# EAGLE schematic PCB-164D316B_sch (EAGLE 9.6.2)
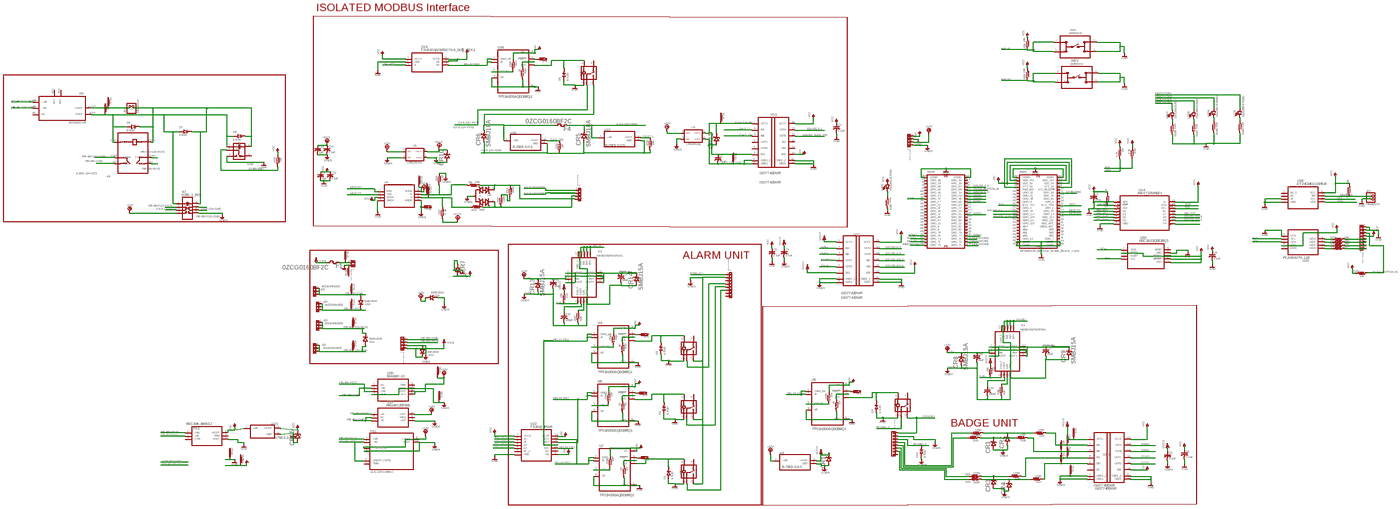
[diagram p0: schematic, sheet 1, overview]
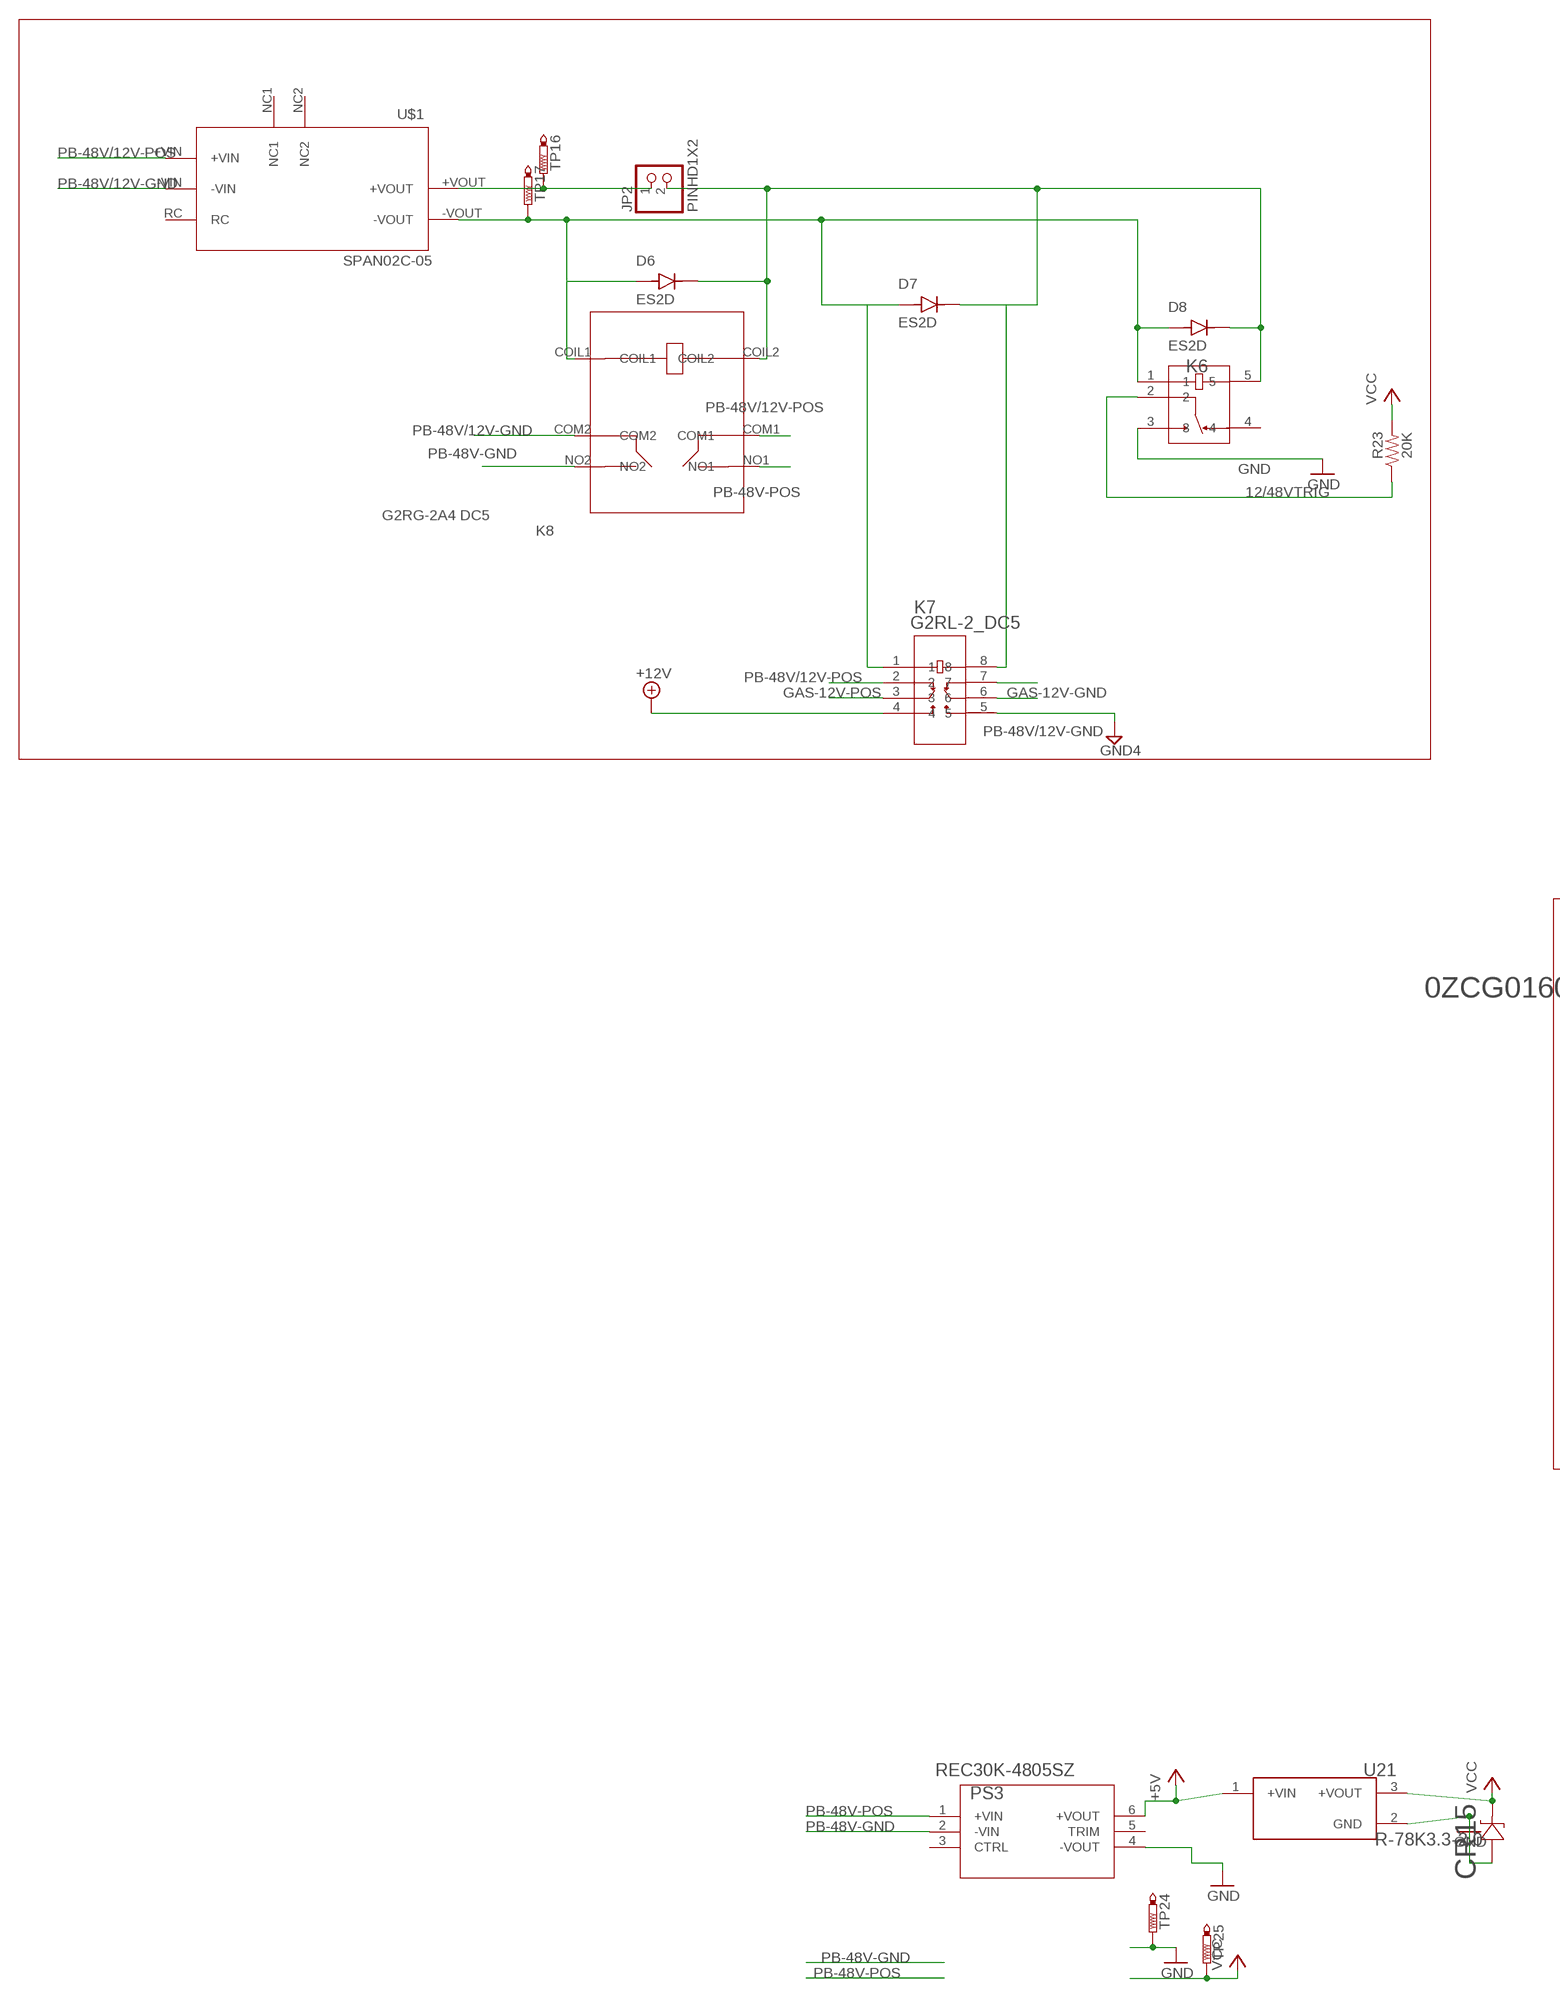
[diagram p1: schematic, sheet 1, part 1 of 4]
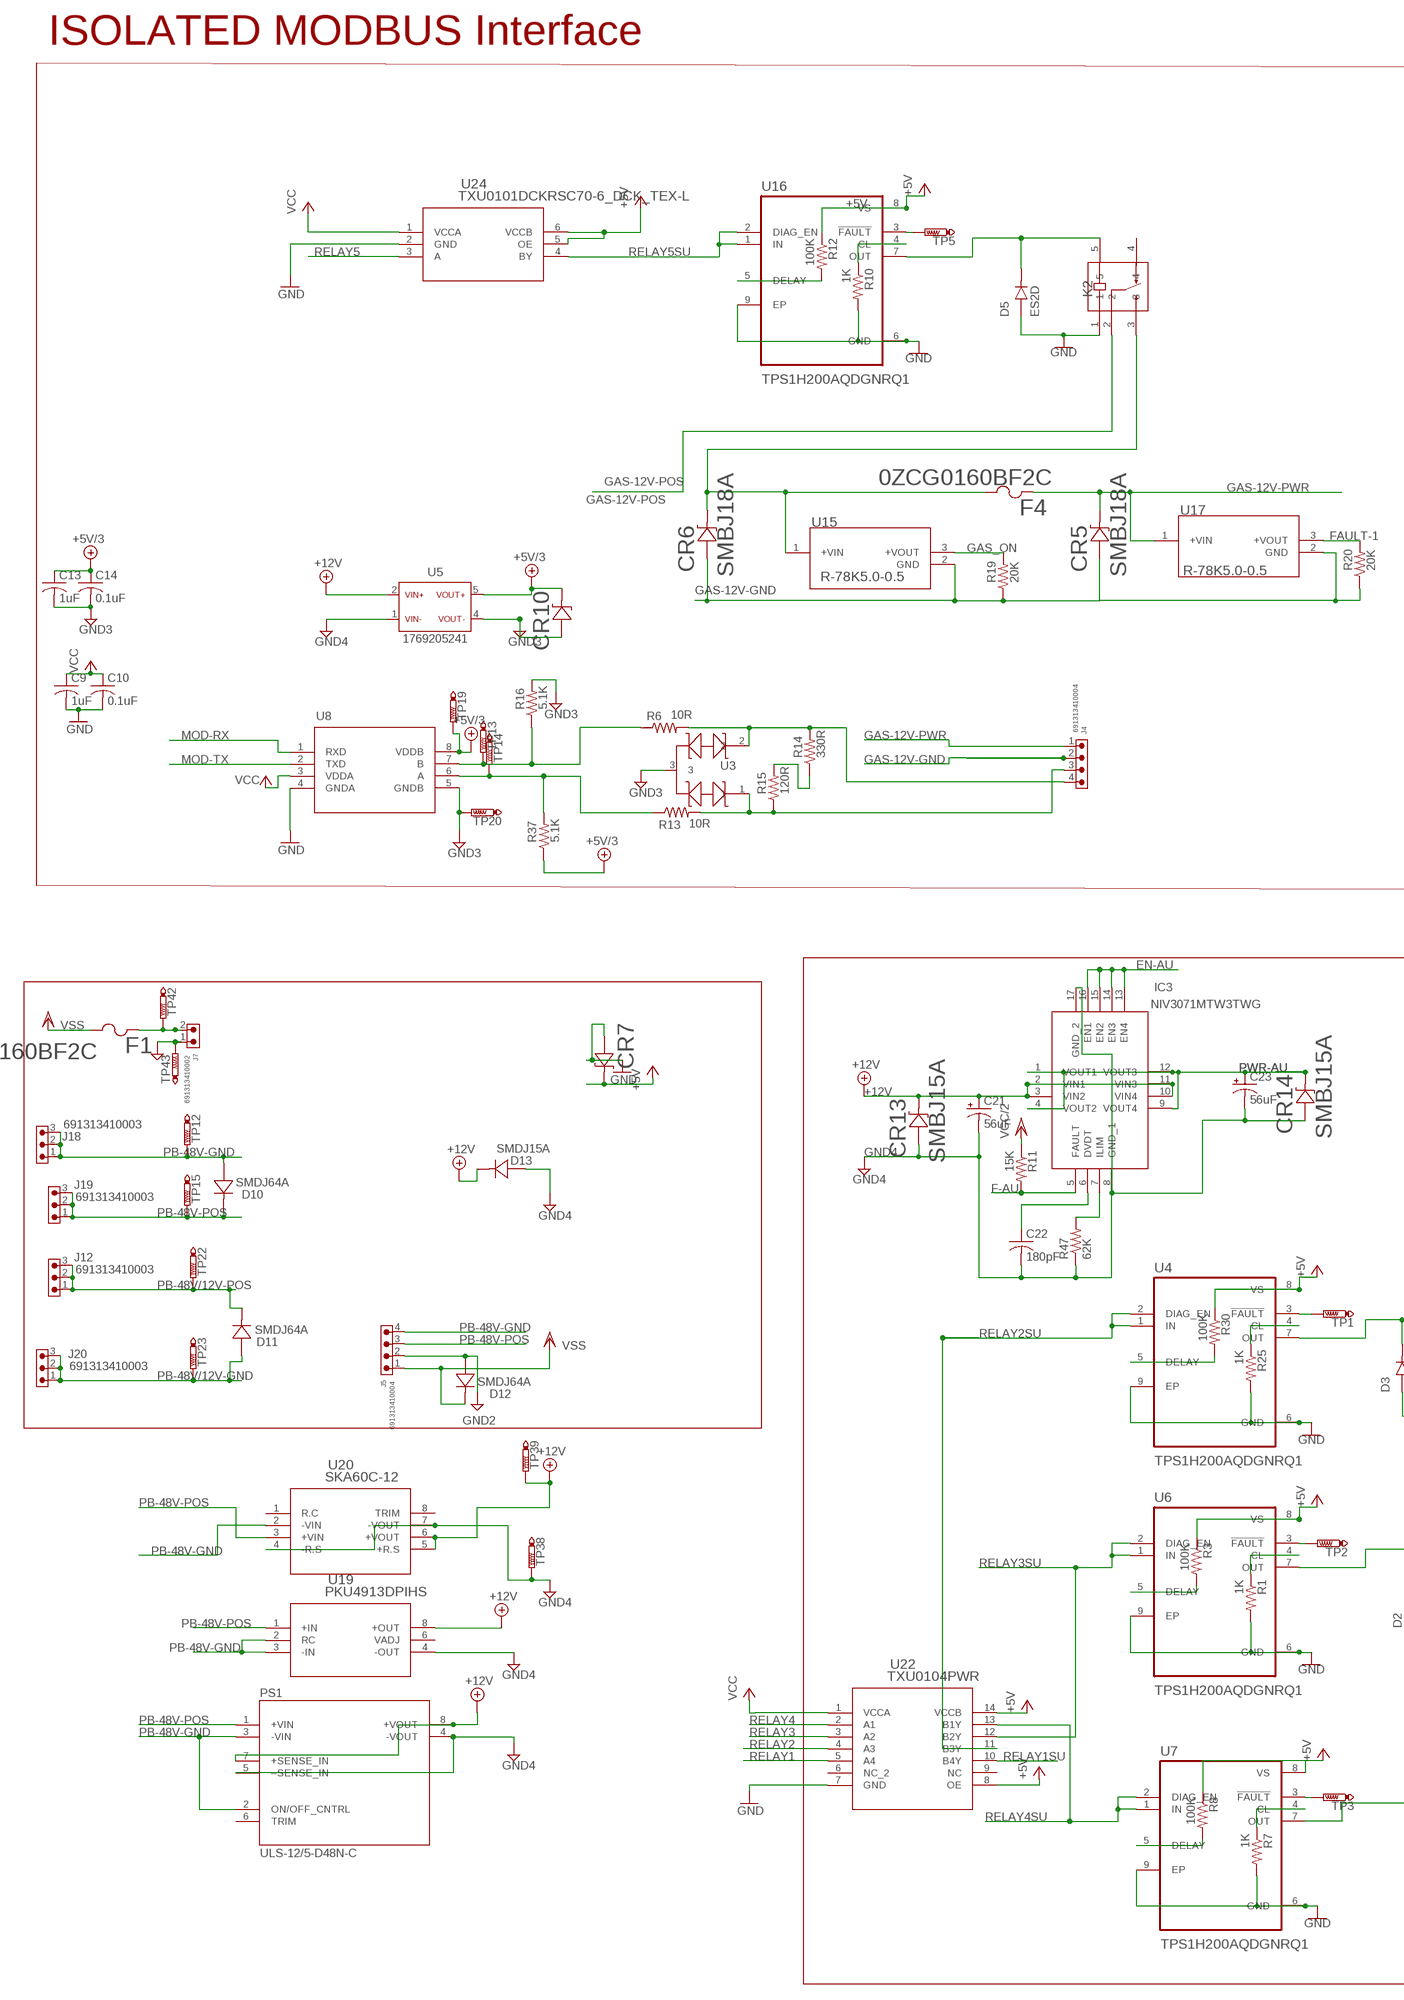
[diagram p2: schematic, sheet 1, part 2 of 4]
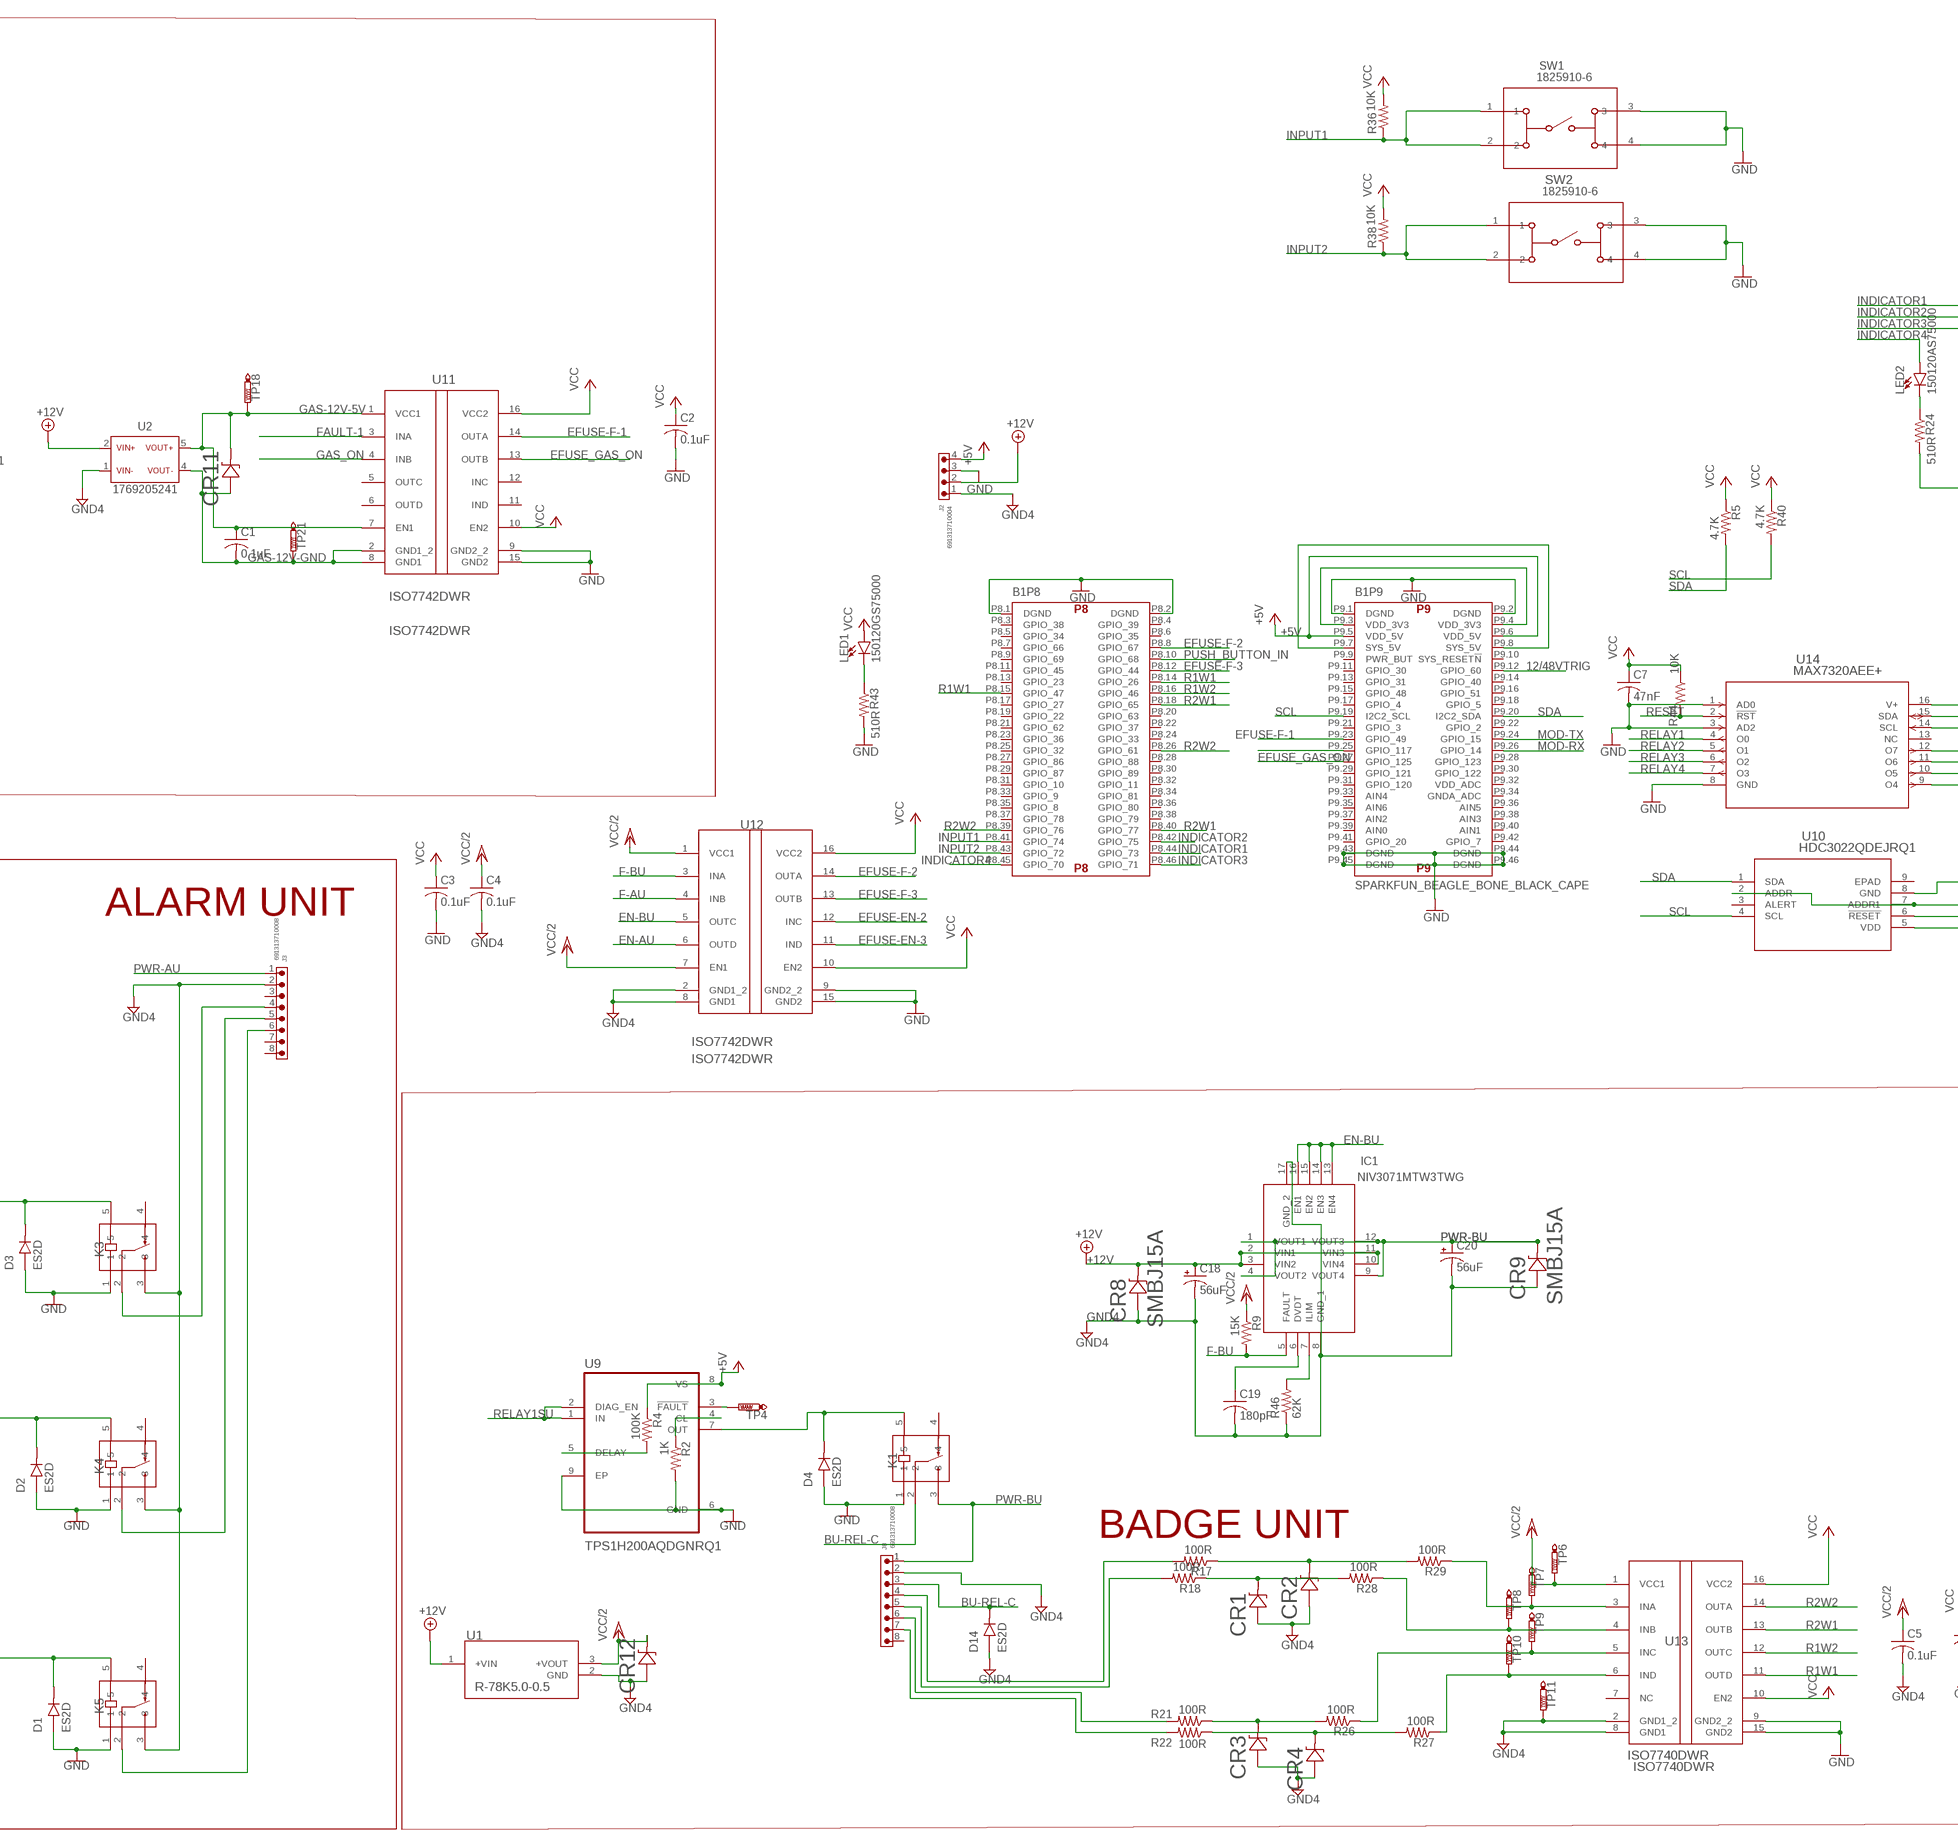
[diagram p3: schematic, sheet 1, part 3 of 4]
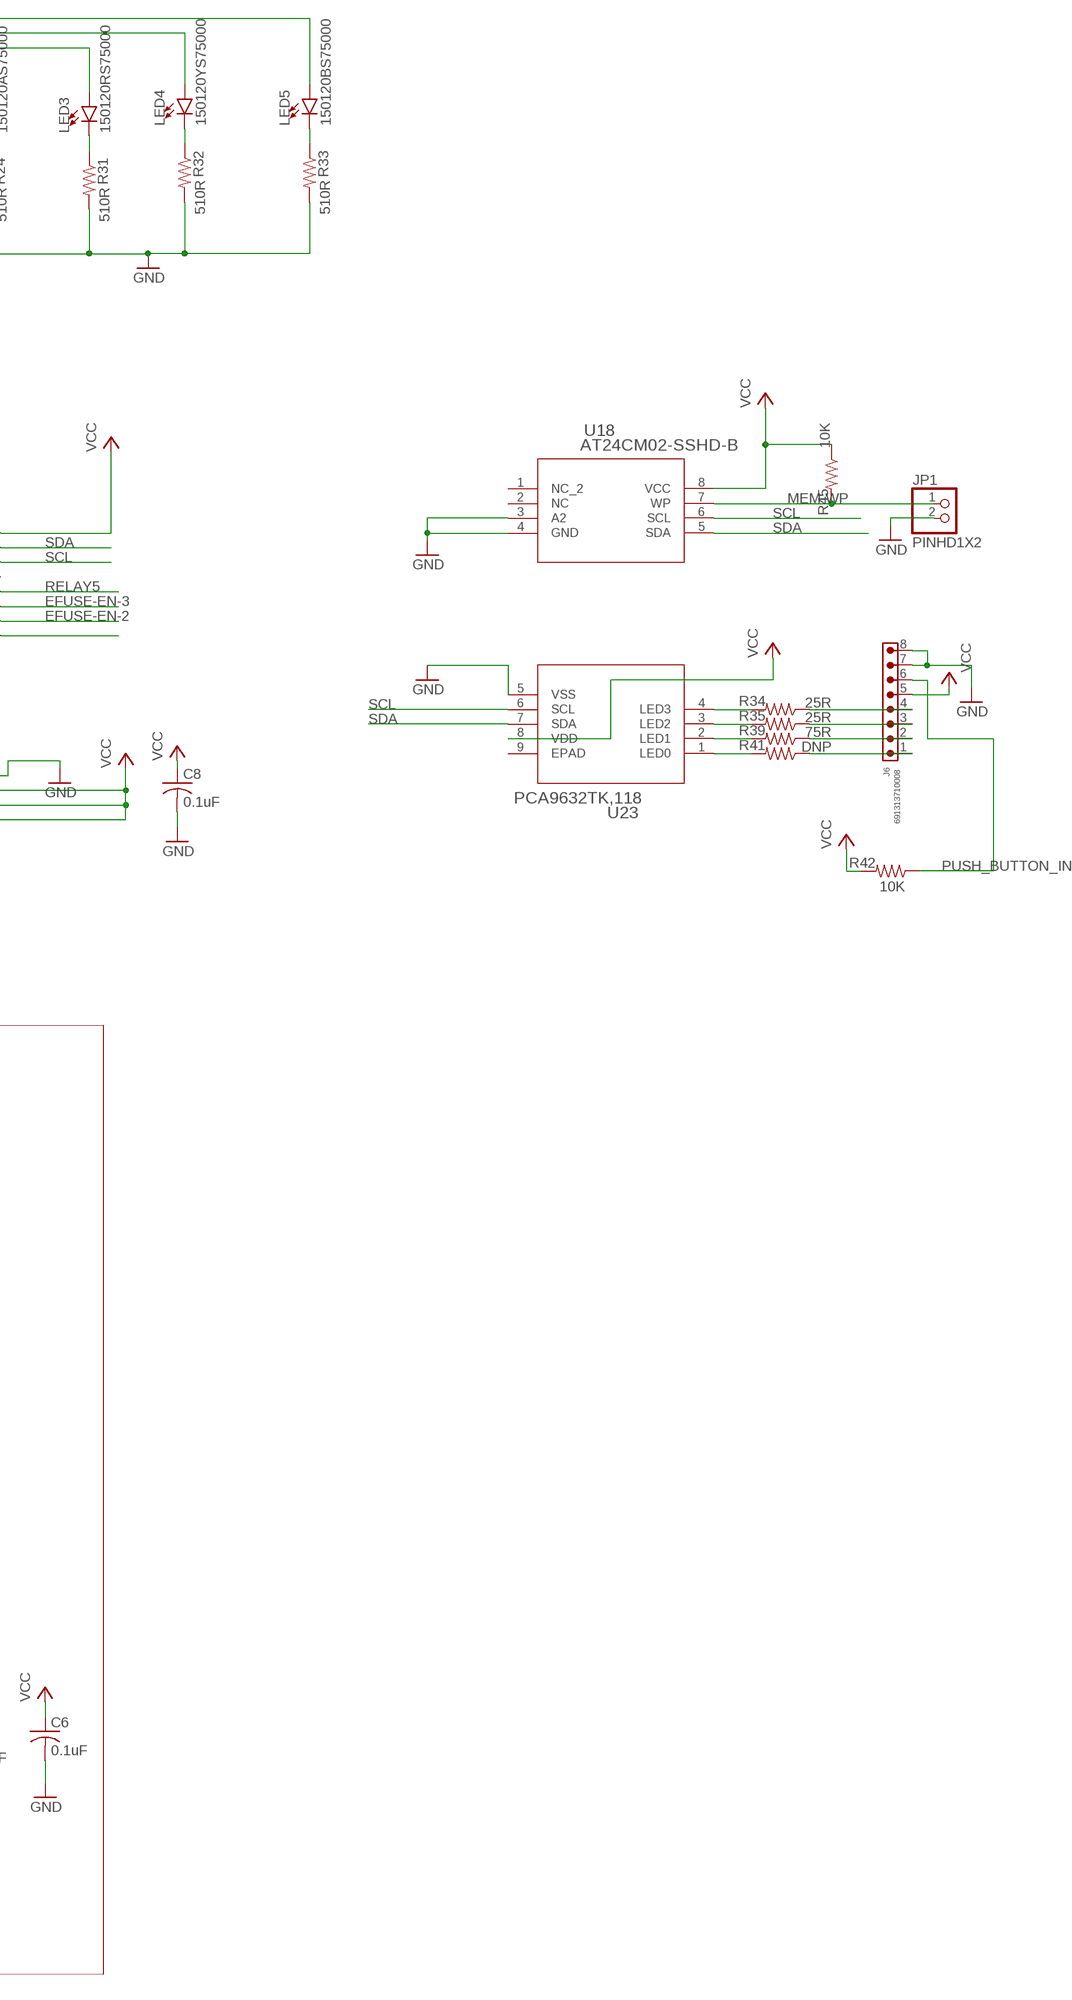
[diagram p4: schematic, sheet 1, part 4 of 4]

## Parts
B1  SPARKFUN_BEAGLE_BONE_BLACK_CAPE  [BEAGLE_BONE_BLACK_CAPE]
C1  0.1uF  C-USC1206  [C1206]
C2  0.1uF  C-USC1206  [C1206]
C3  0.1uF  C-USC1206  [C1206]
C4  0.1uF  C-USC1206  [C1206]
C5  0.1uF  C-USC1206  [C1206]
C6  0.1uF  C-USC1206  [C1206]
C7  47nF  C-USC1206  [C1206]
C8  0.1uF  C-USC1206  [C1206]
C9  1uF  C-USC1206  [C1206]
C10  0.1uF  C-USC1206  [C1206]
C13  1uF  C-USC1206  [C1206]
C14  0.1uF  C-USC1206  [C1206]
C18  56uF  CPOL-USC  [PANASONIC_C]
C19  180pF  C-USC1206  [C1206]
C20  56uF  CPOL-USC  [PANASONIC_C]
C21  56uF  CPOL-USC  [PANASONIC_C]
C22  180pF  C-USC1206  [C1206]
C23  56uF  CPOL-USC  [PANASONIC_C]
CR1  SMBJ6.0A  SMBJ5.0ADO-214AA(SMB_J-BEND)_LTF-M  [DO-214AA(SMB_J-BEND)_LTF-M]
CR2  SMBJ6.0A  SMBJ5.0ADO-214AA(SMB_J-BEND)_LTF-M  [DO-214AA(SMB_J-BEND)_LTF-M]
CR3  SMBJ6.0A  SMBJ5.0ADO-214AA(SMB_J-BEND)_LTF-M  [DO-214AA(SMB_J-BEND)_LTF-M]
CR4  SMBJ6.0A  SMBJ5.0ADO-214AA(SMB_J-BEND)_LTF-M  [DO-214AA(SMB_J-BEND)_LTF-M]
CR5  SMBJ18A  SMBJ5.0ADO-214AA(SMB_J-BEND)_LTF-M  [DO-214AA(SMB_J-BEND)_LTF-M]
CR6  SMBJ18A  SMBJ5.0ADO-214AA(SMB_J-BEND)_LTF-M  [DO-214AA(SMB_J-BEND)_LTF-M]
CR7  SMBJ6.0A  SMBJ5.0ADO-214AA(SMB_J-BEND)_LTF-M  [DO-214AA(SMB_J-BEND)_LTF-M]
CR8  SMBJ15A  SMBJ5.0ADO-214AA(SMB_J-BEND)_LTF-M  [DO-214AA(SMB_J-BEND)_LTF-M]
CR9  SMBJ15A  SMBJ5.0ADO-214AA(SMB_J-BEND)_LTF-M  [DO-214AA(SMB_J-BEND)_LTF-M]
CR10  SMBJ6.0A  SMBJ5.0ADO-214AA(SMB_J-BEND)_LTF-M  [DO-214AA(SMB_J-BEND)_LTF-M]
CR11  SMBJ6.0A  SMBJ5.0ADO-214AA(SMB_J-BEND)_LTF-M  [DO-214AA(SMB_J-BEND)_LTF-M]
CR12  SMBJ6.0A  SMBJ5.0ADO-214AA(SMB_J-BEND)_LTF-M  [DO-214AA(SMB_J-BEND)_LTF-M]
CR13  SMBJ15A  SMBJ5.0ADO-214AA(SMB_J-BEND)_LTF-M  [DO-214AA(SMB_J-BEND)_LTF-M]
CR14  SMBJ15A  SMBJ5.0ADO-214AA(SMB_J-BEND)_LTF-M  [DO-214AA(SMB_J-BEND)_LTF-M]
CR15  SMBJ6.0A  SMBJ5.0ADO-214AA(SMB_J-BEND)_LTF-M  [DO-214AA(SMB_J-BEND)_LTF-M]
D1  ES2D  [DIOM4336X265N]
D2  ES2D  [DIOM4336X265N]
D3  ES2D  [DIOM4336X265N]
D4  ES2D  [DIOM4336X265N]
D5  ES2D  [DIOM4336X265N]
D6  ES2D  [DIOM4336X265N]
D7  ES2D  [DIOM4336X265N]
D8  ES2D  [DIOM4336X265N]
D10  SMDJ64A  SMDJ64ASMDJSERIES_LTF-M  [SMDJSERIES_LTF-M]
D11  SMDJ64A  SMDJ64ASMDJSERIES_LTF-M  [SMDJSERIES_LTF-M]
D12  SMDJ64A  SMDJ64ASMDJSERIES_LTF-M  [SMDJSERIES_LTF-M]
D13  SMDJ15A  SMDJ64ASMDJSERIES_LTF-M  [SMDJSERIES_LTF-M]
D14  ES2D  [DIOM4336X265N]
F1  0ZCG0160BF2C  0ZCG0160BF2C0ZCG_BEL  [0ZCG_BEL]
F4  0ZCG0160BF2C  0ZCG0160BF2C0ZCG_BEL  [0ZCG_BEL]
IC1  NIV3071MTW3TWG  [QFN105P500X600X80-17N]
IC3  NIV3071MTW3TWG  [QFN105P500X600X80-17N]
J2  691313710004  691313710004  [691313710004]
J3  691313710008  691313710008  [691313710008]
J4  691313410004  691313410004  [691313410004]
J5  691313410004  691313410004  [691313410004]
J6  691313710008  691313710008  [691313710008]
J7  691313410002  691313410002  [691313410002]
J8  691313710008  691313710008  [691313710008]
J12  691313410003  691313410003  [691313410003]
J18  691313410003  691313410003  [691313410003]
J19  691313410003  691313410003  [691313410003]
J20  691313410003  691313410003  [691313410003]
JP1  PINHD1X2  PINHD-1X2  [1X02]
JP2  PINHD1X2  PINHD-1X2  [1X02]
K1  G5Q-14_DC5  G5Q-14_DC5RELAY_G5Q-1_DC5_OMR  [RELAY_G5Q-1_DC5_OMR]
K2  G5Q-14_DC5  G5Q-14_DC5RELAY_G5Q-1_DC5_OMR  [RELAY_G5Q-1_DC5_OMR]
K3  G5Q-14_DC5  G5Q-14_DC5RELAY_G5Q-1_DC5_OMR  [RELAY_G5Q-1_DC5_OMR]
K4  G5Q-14_DC5  G5Q-14_DC5RELAY_G5Q-1_DC5_OMR  [RELAY_G5Q-1_DC5_OMR]
K5  G5Q-14_DC5  G5Q-14_DC5RELAY_G5Q-1_DC5_OMR  [RELAY_G5Q-1_DC5_OMR]
K6  G5Q-14_DC5  G5Q-14_DC5RELAY_G5Q-1_DC5_OMR  [RELAY_G5Q-1_DC5_OMR]
K7  G2RL-2_DC5  G2RL-2_DC5RELAY_G2RL-2_OMR  [RELAY_G2RL-2_OMR]
K8  G2RG-2A4 DC5  OMRON_G2RG-2A-XDC12  [G2RG-2A4]
LED1  150120GS75000  LED1206  [LED-1206]
LED2  150120AS75000  LED1206  [LED-1206]
LED3  150120RS75000  LED1206  [LED-1206]
LED4  150120YS75000  LED1206  [LED-1206]
LED5  150120BS75000  LED1206  [LED-1206]
PS1  ULS-12/5-D48N-C  ULS-12/5-D48N-C  [CONV_ULS-12/5-D48N-C]
PS3  REC30K-4805SZ  REC20K-2405SZREC20K_RCP  [REC20K_RCP]
R1  1K  R-US_R1206  [R1206]
R2  1K  R-US_R1206  [R1206]
R3  100K  R-US_R1206  [R1206]
R4  100K  R-US_R1206  [R1206]
R5  4.7K  R-US_R1206  [R1206]
R6  10R  R-US_R1206  [R1206]
R7  1K  R-US_R1206  [R1206]
R8  100K  R-US_R1206  [R1206]
R9  15K  R-US_R1206  [R1206]
R10  1K  R-US_R1206  [R1206]
R11  15K  R-US_R1206  [R1206]
R12  100K  R-US_R1206  [R1206]
R13  10R  R-US_R1206  [R1206]
R14  330R  R-US_R1206  [R1206]
R15  120R  R-US_R1206  [R1206]
R16  5.1K  R-US_R1206  [R1206]
R17  100R  R-US_R1206  [R1206]
R18  100R  R-US_R1206  [R1206]
R19  20K  R-US_R1206  [R1206]
R20  20K  R-US_R1206  [R1206]
R21  100R  R-US_R1206  [R1206]
R22  100R  R-US_R1206  [R1206]
R23  20K  R-US_R1206  [R1206]
R24  510R  R-US_R1206  [R1206]
R25  1K  R-US_R1206  [R1206]
R26  100R  R-US_R1206  [R1206]
R27  100R  R-US_R1206  [R1206]
R28  100R  R-US_R1206  [R1206]
R29  100R  R-US_R1206  [R1206]
R30  100K  R-US_R1206  [R1206]
R31  510R  R-US_R1206  [R1206]
R32  510R  R-US_R1206  [R1206]
R33  510R  R-US_R1206  [R1206]
R34  25R  R-US_R1206  [R1206]
R35  25R  R-US_R1206  [R1206]
R36  10K  R-US_R1206  [R1206]
R37  5.1K  R-US_R1206  [R1206]
R38  10K  R-US_R1206  [R1206]
R39  75R  R-US_R1206  [R1206]
R40  4.7K  R-US_R1206  [R1206]
R41  DNP  R-US_R1206  [R1206]
R42  10K  R-US_R1206  [R1206]
R43  510R  R-US_R1206  [R1206]
R44  10K  R-US_R1206  [R1206]
R45  10K  R-US_R1206  [R1206]
R46  62K  R-US_R1206  [R1206]
R47  62K  R-US_R1206  [R1206]
SW1  1825910-6  1825910-6SW4_1825910-B_TEC  [SW4_1825910-B_TEC]
SW2  1825910-6  1825910-6SW4_1825910-B_TEC  [SW4_1825910-B_TEC]
TP1  TH  [SMALL-TH]
TP2  TH  [SMALL-TH]
TP3  TH  [SMALL-TH]
TP4  TH  [SMALL-TH]
TP5  TH  [SMALL-TH]
TP6  TH  [SMALL-TH]
TP7  TH  [SMALL-TH]
TP8  TH  [SMALL-TH]
TP9  TH  [SMALL-TH]
TP10  TH  [SMALL-TH]
TP11  TH  [SMALL-TH]
TP12  TH  [SMALL-TH]
TP13  TH  [SMALL-TH]
TP14  TH  [SMALL-TH]
TP15  TH  [SMALL-TH]
TP16  TH  [SMALL-TH]
TP17  TH  [SMALL-TH]
TP18  TH  [SMALL-TH]
TP19  TH  [SMALL-TH]
TP20  TH  [SMALL-TH]
TP21  TH  [SMALL-TH]
TP22  TH  [SMALL-TH]
TP23  TH  [SMALL-TH]
TP24  TH  [SMALL-TH]
TP25  TH  [SMALL-TH]
TP38  TH  [SMALL-TH]
TP39  TH  [SMALL-TH]
TP42  TH  [SMALL-TH]
TP43  TH  [SMALL-TH]
U1  R-78K5.0-0.5  R-78K5.0-0.5SIP3_R-78K-0.5_RCP  [SIP3_R-78K-0.5_RCP]
U2  1769205241  WPME-FISM_SMT-8_1769205241_L13.2W11.4H7.25  [WPME-FISM_SMT-8_L13.2W11.4H7.25]
U3  SM712.TCT  SM712.TCTSOT23_SEM-M  [SOT23_SEM-M]
U4  TPS1H200AQDGNRQ1  [SOP65P490X110-9N]
U5  1769205241  WPME-FISM_SMT-8_1769205241_L13.2W11.4H7.25  [WPME-FISM_SMT-8_L13.2W11.4H7.25]
U6  TPS1H200AQDGNRQ1  [SOP65P490X110-9N]
U7  TPS1H200AQDGNRQ1  [SOP65P490X110-9N]
U8  MAX22026FAWA+  MAX22026FAWA+21-0262_W8MS+1_ADI-M  [21-0262_W8MS+1_ADI-M]
U9  TPS1H200AQDGNRQ1  [SOP65P490X110-9N]
U10  HDC3022QDEJRQ1  HDC3022QDEJRQ1WSON8_DEJ_TEX-M  [WSON8_DEJ_TEX-M]
U11  ISO7742DWR  ISO7742DWRDW0016B_HV  [DW0016B_HV]
U12  ISO7742DWR  ISO7742DWRDW0016B_HV  [DW0016B_HV]
U13  ISO7740DWR  ISO7740DWRDW0016B_HV  [DW0016B_HV]
U14  MAX7320AEE+  MAX7320AEE+T21-0055H_16_MXM-M  [21-0055H_16_MXM-M]
U15  R-78K5.0-0.5  R-78K5.0-0.5SIP3_R-78K-0.5_RCP  [SIP3_R-78K-0.5_RCP]
U16  TPS1H200AQDGNRQ1  [SOP65P490X110-9N]
U17  R-78K5.0-0.5  R-78K5.0-0.5SIP3_R-78K-0.5_RCP  [SIP3_R-78K-0.5_RCP]
U18  AT24CM02-SSHD-B  AT24CM02-SSHD-BSOIC8_4P9X3P9MC_MCH-L  [SOIC8_4P9X3P9MC_MCH-L]
U19  PKU4913DPIHS  PKU4913DPIHSPKU4913DPIHS_FPM  [PKU4913DPIHS_FPM]
U20  SKA60C-12  SKA60C-12SKA60_MWU  [SKA60_MWU]
U21  R-78K3.3-2.0  [CONV_R-78K3.3-2.0]
U22  TXU0104PWR  TXU0104PWRTSSOP_0104PWR_TEX-L  [TSSOP_0104PWR_TEX-L]
U23  PCA9632TK,118  PCA9632TK,118HVSON8_3X3_NXP  [HVSON8_3X3_NXP]
U24  TXU0101DCKRSC70-6_DCK_TEX-L  [SC70-6_DCK_TEX-L]
U$1  SPAN02C-05  MEANWELLSPBW03G-12  [SPBW03G-12]

## Nets
12/48VTRIG: B1.P9.12(P9:GPIO_60) K6.2 R23.1
+5V: B1.P9.5(P9:VDD_5V) B1.P9.6(P9:VDD_5V) CR7.1(CATHODE) J2.4 PS3.6(+VOUT) R3.1 R4.1 R8.1 R12.1 R30.1 U4.8(VS) U6.8(VS) U7.8(VS) U9.8(VS) U16.8(VS) U21.1(+VIN) U22.8(OE) U22.14(VCCB) U24.5(OE) U24.6(VCCB)
+5V/3: C13.1 C14.1 CR10.1(CATHODE) R37.1 TP19.P$1(TP) U5.5(+VOUT) U8.8(VDDB)
+12V: C18.+ C21.+ CR8.1(CATHODE) CR13.1(CATHODE) D13.1 IC1.2(VIN1) IC1.3(VIN2) IC1.10(VIN4) IC1.11(VIN3) IC3.2(VIN1) IC3.3(VIN2) IC3.10(VIN4) IC3.11(VIN3) J2.2 K7.4 PS1.7(+SENSE_IN) PS1.8(+VOUT) TP39.P$1(TP) U1.1(+VIN) U2.2(+VIN) U5.2(+VIN) U19.8(+OUT) U20.5(+R.S) U20.6(+VOUT)
BU-REL-C: D14.C(K) J8.3 K1.2
EFUSE-EN-2: U12.12(INC) U14.10(O5)
EFUSE-EN-3: U12.11(IND) U14.11(O6)
EFUSE-F-1: B1.P9.23(P9:GPIO_49) U11.14(OUTA)
EFUSE-F-2: B1.P8.8(P8:GPIO_67) U12.14(OUTA)
EFUSE-F-3: B1.P8.12(P8:GPIO_44) U12.13(OUTB)
EFUSE_GAS_ON: B1.P9.27(P9:GPIO_125) U11.13(OUTB)
EN-AU: IC3.13(EN4) IC3.14(EN3) IC3.15(EN2) IC3.16(EN1) U12.6(OUTD)
EN-BU: IC1.13(EN4) IC1.14(EN3) IC1.15(EN2) IC1.16(EN1) U12.5(OUTC)
F-AU: IC3.5(FAULT) R11.2 U12.4(INB)
F-BU: IC1.5(FAULT) R9.2 U12.3(INA)
FAULT-1: R20.2 U11.3(INA) U17.3(+VOUT)
GAS-12V-5V: C1.1 CR11.1(CATHODE) TP18.P$1(TP) U2.5(+VOUT) U11.1(VCC1) U11.7(EN1)
GAS-12V-GND: C1.2 CR5.2(ANODE) CR6.2(ANODE) CR11.2(ANODE) J4.2 K7.6 R19.1 R20.1 TP21.P$1(TP) U2.4(-VOUT) U11.2(GND1_2) U11.8(GND1) U15.2(GND) U17.2(GND)
GAS-12V-POS: K2.2 K7.3
GAS-12V-PWR: CR5.1(CATHODE) F4.1 J4.1 U17.1(+VIN)
GAS_ON: R19.2 U11.4(INB) U15.3(+VOUT)
GND: B1.P8.1(P8:DGND) B1.P8.2(P8:DGND) B1.P9.1(P9:DGND) B1.P9.2(P9:DGND) B1.P9.43(P9:DGND) B1.P9.44(P9:DGND) B1.P9.45(P9:DGND) B1.P9.46(P9:DGND) C2.2 C3.2 C6.2 C7.2 C8.2 C9.2 C10.2 CR7.2(ANODE) CR15.2(ANODE) D1.A D2.A D3.A D4.A D5.A J2.3 J6.7 J6.8 JP1.2 K1.1 K2.1 K3.1 K4.1 K5.1 K6.3 PS3.4(-VOUT) R1.2 R2.2 R7.2 R10.2 R24.2 R25.2 R31.2 R32.2 R33.2 R43.2 SW1.3 SW1.4 SW2.3 SW2.4 TP24.P$1(TP) U4.6(GND) U4.9(EP) U6.6(GND) U6.9(EP) U7.6(GND) U7.9(EP) U8.4(GNDA) U9.6(GND) U9.9(EP) U10.8(GND) U11.9(GND2_2) U11.15(GND2) U12.9(GND2_2) U12.15(GND2) U13.9(GND2_2) U13.15(GND2) U14.1(AD0) U14.3(AD2) U14.8(GND) U16.6(GND) U16.9(EP) U18.3(A2) U18.4(GND) U21.2(GND) U22.7(GND) U23.5(VSS) U24.2(GND)
GND2 [Power]: D12.2 J5.2 J7.1 TP43.P$1(TP)
GND3: C13.2 C14.2 CR10.2(ANODE) R16.2 TP20.P$1(TP) U3.3 U5.4(-VOUT) U8.5(GNDB)
GND4: C4.2 C5.2 C18.- C19.2 C20.- C21.- C22.2 C23.- CR1.2(ANODE) CR2.2(ANODE) CR3.2(ANODE) CR4.2(ANODE) CR8.2(ANODE) CR9.2(ANODE) CR12.2(ANODE) CR13.2(ANODE) CR14.2(ANODE) D13.2 D14.A IC1.8(GND_1) IC1.17(GND_2) IC3.8(GND_1) IC3.17(GND_2) J2.1 J3.2 J8.2 K3.3 K4.3 K5.3 K7.5 PS1.4(-VOUT) PS1.5(–SENSE_IN) R46.1 R47.1 TP11.P$1(TP) TP38.P$1(TP) U1.2(GND) U2.1(-VIN) U5.1(-VIN) U12.2(GND1_2) U12.8(GND1) U13.2(GND1_2) U13.8(GND1) U19.4(-OUT) U20.4(-R.S) U20.7(-VOUT)
INDICATOR1: B1.P8.44(P8:GPIO_73) LED5.A
INDICATOR2: B1.P8.42(P8:GPIO_75) LED4.A
INDICATOR3: B1.P8.46(P8:GPIO_71) LED3.A
INDICATOR4: B1.P8.45(P8:GPIO_70) LED2.A
INPUT1: B1.P8.41(P8:GPIO_74) R36.1 SW1.1 SW1.2
INPUT2: B1.P8.43(P8:GPIO_72) R38.1 SW2.1 SW2.2
MEM-WP: JP1.1 R45.2 U18.7(WP)
MOD-RX: B1.P9.26(P9:GPIO_14) U8.1(RXD)
MOD-TX: B1.P9.24(P9:GPIO_15) U8.2(TXD)
N$1: CR6.1(CATHODE) F4.2 K2.3 U15.1(+VIN)
N$2: R2.1 U9.4(CL)
N$3: D3.C(K) K3.5 U4.7(OUT)
N$4: R1.1 U6.4(CL)
N$5: TP1.P$1(TP) U4.3(!FAULT)
N$6: R28.1 TP8.P$1(TP) U13.4(INB)
N$7: CR3.1(CATHODE) R21.1 R26.2
N$8: CR4.1(CATHODE) R22.1 R27.2
N$9: CR2.1(CATHODE) R17.1 R29.2
N$10: R29.1 TP7.P$1(TP) U13.3(INA)
N$11: CR1.1(CATHODE) R18.1 R28.2
N$12: R4.2 U9.5(DELAY)
N$13: R6.1 R16.1 TP13.P$1(TP) U8.7(B)
N$14: R14.1 R15.2
N$15: TP4.P$1(TP) U9.3(!FAULT)
N$16: R13.1 R37.2 TP14.P$1(TP) U8.6(A)
N$17: J4.4 R6.2 R14.2 U3.2
N$18: R10.1 U16.4(CL)
N$19: D1.C(K) K5.5 U7.7(OUT)
N$20: B1.P9.25(P9:GPIO_117)
N$21: R12.2 U16.5(DELAY)
N$22: R3.2 U6.5(DELAY)
N$23: B1.P9.3(P9:VDD_3V3) B1.P9.4(P9:VDD_3V3)
N$24: J3.6 K5.2
N$25: B1.P9.7(P9:SYS_5V) B1.P9.8(P9:SYS_5V)
N$26: J3.5 K4.2
N$27: R26.1 TP9.P$1(TP) U13.5(INC)
N$28: J3.4 K3.2
N$29: D5.C(K) K2.5 U16.7(OUT)
N$30: D2.C(K) K4.5 U6.7(OUT)
N$31: R7.1 U7.4(CL)
N$32: C19.1 IC1.6(DVDT)
N$33: TP3.P$1(TP) U7.3(!FAULT)
N$34: TP5.P$1(TP) U16.3(!FAULT)
N$35: R27.1 TP10.P$1(TP) U13.6(IND)
N$36: D6.A D7.A D8.A K6.1 K7.1 K8.COIL1 TP17.P$1(TP) U$1.-VOUT
N$37: R8.2 U7.5(DELAY)
N$38: J8.4 R17.2
N$39: J8.5 R18.2
N$40: J8.6 R21.2
N$41: J8.7 R22.2
N$42: TP2.P$1(TP) U6.3(!FAULT)
N$43: D4.C(K) K1.5 U9.7(OUT)
N$44: JP2.1 TP16.P$1(TP) U$1.+VOUT
N$45: U14.9(O4)
N$47: IC1.7(ILIM) R46.2
N$48: J4.3 R13.2 R15.1 U3.1
N$49: D6.C(K) D7.C(K) D8.C(K) JP2.2 K6.5 K7.8 K8.COIL2
N$52: LED2.C R24.1
N$53: LED3.C R31.1
N$54: LED4.C R32.1
N$55: LED5.C R33.1
N$56: R25.1 U4.4(CL)
N$57: R30.2 U4.5(DELAY)
N$59: R34.2 U23.4(LED3)
N$60: R35.2 U23.3(LED2)
N$61: R39.2 U23.2(LED1)
N$62: R41.2 U23.1(LED0)
N$63: J6.4 R34.1
N$64: LED1.C R43.1
N$66: J6.3 R35.1
N$67: C22.1 IC3.6(DVDT)
N$68: IC3.7(ILIM) R47.2
N$69: J6.2 R39.1
N$71: J6.1 R41.1
N$73: F1.1 J7.2 TP42.P$1(TP)
PB-48V-GND [Power]: D10.2 J5.4 J18.1 J18.2 J18.3 K8.NO2 PS1.2(ON/OFF_CNTRL) PS1.3(-VIN) PS3.2(-VIN) TP12.P$1(TP) U19.2(RC) U19.3(-IN) U20.2(-VIN)
PB-48V-POS [Power]: D10.1 J5.3 J19.1 J19.2 J19.3 K8.NO1 PS1.1(+VIN) PS3.1(+VIN) TP15.P$1(TP) U19.1(+IN) U20.3(+VIN)
PB-48V/12V-GND [Power]: D11.2 J20.1 J20.2 J20.3 K7.7 K8.COM2 TP23.P$1(TP) U$1.-VIN
PB-48V/12V-POS [Power]: D11.1 J12.1 J12.2 J12.3 K7.2 K8.COM1 TP22.P$1(TP) U$1.+VIN
PUSH_BUTTON_IN: B1.P8.10(P8:GPIO_68) J6.6 R42.1
PWR-AU: C23.+ CR14.1(CATHODE) IC3.1(VOUT1) IC3.4(VOUT2) IC3.9(VOUT4) IC3.12(VOUT3) J3.1
PWR-BU: C20.+ CR9.1(CATHODE) IC1.1(VOUT1) IC1.4(VOUT2) IC1.9(VOUT4) IC1.12(VOUT3) J8.1 K1.3
R1W1: B1.P8.14(P8:GPIO_26) B1.P8.15(P8:GPIO_47) U13.11(OUTD)
R1W2: B1.P8.16(P8:GPIO_46) U13.12(OUTC)
R2W1: B1.P8.18(P8:GPIO_65) B1.P8.40(P8:GPIO_77) U13.13(OUTB)
R2W2: B1.P8.26(P8:GPIO_61) B1.P8.39(P8:GPIO_76) U13.14(OUTA)
RELAY1: U14.4(O0) U22.5(A4)
RELAY1SU: U9.1(IN) U9.2(DIAG_EN) U22.10(B4Y)
RELAY2: U14.5(O1) U22.4(A3)
RELAY2SU: U4.1(IN) U4.2(DIAG_EN) U22.11(B3Y)
RELAY3: U14.6(O2) U22.3(A2)
RELAY3SU: U6.1(IN) U6.2(DIAG_EN) U22.12(B2Y)
RELAY4: U14.7(O3) U22.2(A1)
RELAY4SU: U7.1(IN) U7.2(DIAG_EN) U22.13(B1Y)
RELAY5: U14.12(O7) U24.3(A)
RELAY5SU: U16.1(IN) U16.2(DIAG_EN) U24.4(BY)
RESET: R44.2 U14.2(!RST)
SCL: B1.P9.19(P9:I2C2_SCL) R40.2 U10.4(SCL) U14.14(SCL) U18.6(SCL) U23.6(SCL)
SDA: B1.P9.20(P9:I2C2_SDA) R5.2 U10.1(SDA) U14.15(SDA) U18.5(SDA) U23.7(SDA)
VCC: C2.1 C3.1 C6.1 C7.1 C8.1 C9.1 C10.1 CR15.1(CATHODE) J6.5 LED1.A R5.1 R23.2 R36.2 R38.2 R40.1 R42.2 R44.1 R45.1 TP25.P$1(TP) U8.3(VDDA) U10.2(ADDR) U10.5(VDD) U10.6(!RESET) U10.7(ADDR1) U11.10(EN2) U11.16(VCC2) U12.10(EN2) U12.16(VCC2) U13.10(EN2) U13.16(VCC2) U14.16(V+) U18.8(VCC) U21.3(+VOUT) U22.1(VCCA) U23.8(VDD) U24.1(VCCA)
VCC/2: C4.1 C5.1 CR12.1(CATHODE) R9.1 R11.1 TP6.P$1(TP) U1.3(+VOUT) U12.1(VCC1) U12.7(EN1) U13.1(VCC1)
VSS [Power]: D12.1 F1.2 J5.1
Unconnected: B1.P8.3(P8:GPIO_38) B1.P8.4(P8:GPIO_39) B1.P8.5(P8:GPIO_34) B1.P8.6(P8:GPIO_35) B1.P8.7(P8:GPIO_66) B1.P8.9(P8:GPIO_69) B1.P8.11(P8:GPIO_45) B1.P8.13(P8:GPIO_23) B1.P8.17(P8:GPIO_27) B1.P8.19(P8:GPIO_22) B1.P8.20(P8:GPIO_63) B1.P8.21(P8:GPIO_62) B1.P8.22(P8:GPIO_37) B1.P8.23(P8:GPIO_36) B1.P8.24(P8:GPIO_33) B1.P8.25(P8:GPIO_32) B1.P8.27(P8:GPIO_86) B1.P8.28(P8:GPIO_88) B1.P8.29(P8:GPIO_87) B1.P8.30(P8:GPIO_89) B1.P8.31(P8:GPIO_10) B1.P8.32(P8:GPIO_11) B1.P8.33(P8:GPIO_9) B1.P8.34(P8:GPIO_81) B1.P8.35(P8:GPIO_8) B1.P8.36(P8:GPIO_80) B1.P8.37(P8:GPIO_78) B1.P8.38(P8:GPIO_79) B1.P9.9(P9:PWR_BUT) B1.P9.10(P9:SYS_RESET!N) B1.P9.11(P9:GPIO_30) B1.P9.13(P9:GPIO_31) B1.P9.14(P9:GPIO_40) B1.P9.15(P9:GPIO_48) B1.P9.16(P9:GPIO_51) B1.P9.17(P9:GPIO_4) B1.P9.18(P9:GPIO_5) B1.P9.21(P9:GPIO_3) B1.P9.22(P9:GPIO_2) B1.P9.28(P9:GPIO_123) B1.P9.29(P9:GPIO_121) B1.P9.30(P9:GPIO_122) B1.P9.31(P9:GPIO_120) B1.P9.32(P9:VDD_ADC) B1.P9.33(P9:AIN4) B1.P9.34(P9:GNDA_ADC) B1.P9.35(P9:AIN6) B1.P9.36(P9:AIN5) B1.P9.37(P9:AIN2) B1.P9.38(P9:AIN3) B1.P9.39(P9:AIN0) B1.P9.40(P9:AIN1) B1.P9.41(P9:GPIO_20) B1.P9.42(P9:GPIO_7) J3.3 J3.7 J3.8 J8.8 K1.4 K2.4 K3.4 K4.4 K5.4 K6.4 PS1.6(TRIM) PS3.3(CTRL) PS3.5(TRIM) U10.3(ALERT) U10.9(EPAD) U11.5(OUTC) U11.6(OUTD) U11.11(IND) U11.12(INC) U13.7(NC) U14.13(NC) U18.1(NC_2) U18.2(NC) U19.6(VADJ) U20.1(R.C) U20.8(TRIM) U22.6(NC_2) U22.9(NC) U23.9(EPAD) U$1.NC1 U$1.NC2 U$1.RC

## Notes on the sheet
- ISOLATED MODBUS Interface
- ALARM UNIT
- BADGE UNIT

## Library data of the parts
B1 = SparkFun-Boards:SPARKFUN_BEAGLE_BONE_BLACK_CAPE: BeagleBone Black Rev C Cape Generic footprint for BeagleBone Black Rev C Capes. SparkFun Products: SparkFun BeagleBone Black Proto Cape <https://www.sparkfun.com/products/12774> SparkFun CryptoCape <https://www.sparkfun.com/products/12773>
C1-C10 C13 C14 C19 C22 = adafruit:C-US: CAPACITOR, American symbol
C18 C20 C21 C23 = adafruit:CPOL-US: POLARIZED CAPACITOR, American symbol
CR1-CR15 = SMBJ5_0A:SMBJ5.0A; COPYRIGHT: Copyright (C) 2024 Ultra Librarian. All rights reserved.; MANUFACTURER_PART_NUMBER: SMBJ5.0A; MFR_NAME: Littelfuse Inc
D1-D8 D14 = ES2D:ES2D; CHECK_PRICES: https://www.snapeda.com/parts/ES2D/taiwan/view-part/?ref=eda; DESCRIPTION: 35ns, 2A, 200V, Super Fast Recovery Rectifier; DIGIKEY_PART_NUMBER: 1801-ES2DTR-ND; MF: Taiwan Semiconductor; MP: ES2D; PACKAGE: SMD-2 Taiwan Semiconductor; SNAPEDA_LINK: https://www.snapeda.com/parts/ES2D/taiwan/view-part/?ref=snap
D10-D13 = SMDJ64A:SMDJ64A; COPYRIGHT: Copyright (C) 2025 Ultra Librarian. All rights reserved.; MANUFACTURER_PART_NUMBER: SMDJ64A; MFR_NAME: Littelfuse Inc
F1 F4 = resettable fuse 3.2A:0ZCG0160BF2C; COPYRIGHT: Copyright (C) 2024 Ultra Librarian. All rights reserved.; MANUFACTURER_PART_NUMBER: 0ZCG0160BF2C; MFR_NAME: Belfuse
IC1 IC3 = NIV3071MTW3TWG:NIV3071MTW3TWG: Electronic fuse (eFuse) 4-channel, 8V to 60V, 10A in 5x6mm package Source: Datasheet <https://www.onsemi.com/download/data-sheet/pdf/nis3071-d.pdf>; DESCRIPTION: Electronic fuse (eFuse) 4-channel, 8V to 60V, 10A in 5x6mm package; HEIGHT: 0.8mm; MANUFACTURER_NAME: onsemi; MANUFACTURER_PART_NUMBER: NIV3071MTW3TWG; MOUSER_PART_NUMBER: 863-NIV3071MTW3TWG; MOUSER_PRICE-STOCK: https://www.mouser.co.uk/ProductDetail/onsemi/NIV3071MTW3TWG?qs=Z%252BL2brAPG1LjnaaESAxKkw%3D%3D
J2 = Wago_connectors:691313710004: WR-TBL Serie 3137 - 5.00 mm Close Horizontal PCB Header KIND PROPERTIES Pitch 5 mm MATERIAL PROPERTIES Insulator Material PA66 Insulator Flammability Rating UL94 V-0 Contact Material Brass Contact Plating Tin GENERAL INFORMATION Operating Temperature -40 up to +105 °C Compliance RoHS ELECTRICAL PROPERTIES IR cULus 20 A IR VDE 20 A Working Voltage [cULus] 300 V (AC) Working Voltage [VDE] 300 V (AC) Withstanding Voltage [cULus] 1600 V (AC) Withstanding Voltage [VDE] 2500 V (AC) Contact Resistance [cULus] 20 mΩ Contact Resistance [VDE] 20 mΩ CERTIFICATION cULus Approval E315414 VDE Approval 40023195 <https://www.we-online.com/catalog/media/o33266v209%20Family_WR-TBL_69131371000x.jpg> Details see: https://www.we-online.com/catalog/en/TBL_5_00_3137_CLOSE_HORIZONTAL_PCB_HEADER_69131371000X/ Updated by Ella Wu 2022-07-25 2022(C) Wurth Elektronik; DATASHEET-URL: https://www.we-online.com/redexpert/spec/691313710004?ae; IR-UL: 20A; IR-VDE: 20A; MOUNT: THT; PART-NUMBER: 691313710004; PINS: 4; PITCH: 5mm; TYPE: Horizontal; WORKING-VOLTAGE-UL: 300V (AC); WORKING-VOLTAGE-VDE: 300V (AC)
J3 J6 J8 = Wago_connectors:691313710008: WR-TBL Serie 3137 - 5.00 mm Close Horizontal PCB Header KIND PROPERTIES Pitch 5 mm MATERIAL PROPERTIES Insulator Material PA66 Insulator Flammability Rating UL94 V-0 Contact Material Brass Contact Plating Tin GENERAL INFORMATION Operating Temperature -40 up to +105 °C Compliance RoHS ELECTRICAL PROPERTIES IR cULus 20 A IR VDE 20 A Working Voltage [cULus] 300 V (AC) Working Voltage [VDE] 300 V (AC) Withstanding Voltage [cULus] 1600 V (AC) Withstanding Voltage [VDE] 2500 V (AC) Contact Resistance [cULus] 20 mΩ Contact Resistance [VDE] 20 mΩ CERTIFICATION cULus Approval E315414 VDE Approval 40023195 <https://www.we-online.com/catalog/media/o33266v209%20Family_WR-TBL_69131371000x.jpg> Details see: https://www.we-online.com/catalog/en/TBL_5_00_3137_CLOSE_HORIZONTAL_PCB_HEADER_69131371000X/ Updated by Ella Wu 2022-07-25 2022(C) Wurth Elektronik; DATASHEET-URL: https://www.we-online.com/redexpert/spec/691313710008?ae; IR-UL: 20A; IR-VDE: 20A; MOUNT: THT; PART-NUMBER: 691313710008; PINS: 8; PITCH: 5mm; TYPE: Horizontal; WORKING-VOLTAGE-UL: 300V (AC); WORKING-VOLTAGE-VDE: 300V (AC)
J4 J5 = Wago_connectors:691313410004: WR-TBL Serie 3134 - 7.62 mm Close Horizontal PCB Header KIND PROPERTIES Pitch 7.62 mm MATERIAL PROPERTIES Insulator Material PA66 Insulator Flammability Rating UL94 V-0 Contact Material Brass Contact Plating Tin GENERAL INFORMATION Operating Temperature -40 up to +105 °C Compliance RoHS ELECTRICAL PROPERTIES IR cULus 20 A Working Voltage [cULus] 300 V (AC) Withstanding Voltage [cULus] 1600 V (AC) Contact Resistance [cULus] 20 mΩ CERTIFICATION cULus Approval E315414 <https://www.we-online.com/catalog/media/o33264v209%20Family_WR-TBL_69131341000x.jpg> Details see: https://www.we-online.com/catalog/en/TBL_7_62_3134_CLOSE_HORIZONTAL_PCB_HEADER_69131341000X/ Updated by Ella Wu 2019-12-30 2022(C) Wurth Elektronik; DATASHEET-URL: https://www.we-online.com/redexpert/spec/691313410004?ae; IR-UL: 20A; MOUNT: THT; PART-NUMBER: 691313410004; PINS: 4; PITCH: 7.62mm; TYPE: Horizontal; WORKING-VOLTAGE-UL: 300V (AC)
J7 = Wago_connectors:691313410002: WR-TBL Serie 3134 - 7.62 mm Close Horizontal PCB Header KIND PROPERTIES Pitch 7.62 mm MATERIAL PROPERTIES Insulator Material PA66 Insulator Flammability Rating UL94 V-0 Contact Material Brass Contact Plating Tin GENERAL INFORMATION Operating Temperature -40 up to +105 °C Compliance RoHS ELECTRICAL PROPERTIES IR cULus 20 A Working Voltage [cULus] 300 V (AC) Withstanding Voltage [cULus] 1600 V (AC) Contact Resistance [cULus] 20 mΩ CERTIFICATION cULus Approval E315414 <https://www.we-online.com/catalog/media/o33264v209%20Family_WR-TBL_69131341000x.jpg> Details see: https://www.we-online.com/catalog/en/TBL_7_62_3134_CLOSE_HORIZONTAL_PCB_HEADER_69131341000X/ Updated by Ella Wu 2019-12-30 2022(C) Wurth Elektronik; DATASHEET-URL: https://www.we-online.com/redexpert/spec/691313410002?ae; IR-UL: 20A; MOUNT: THT; PART-NUMBER: 691313410002; PINS: 2; PITCH: 7.62mm; TYPE: Horizontal; WORKING-VOLTAGE-UL: 300V (AC)
J12 J18-J20 = Wago_connectors:691313410003: WR-TBL Serie 3134 - 7.62 mm Close Horizontal PCB Header KIND PROPERTIES Pitch 7.62 mm MATERIAL PROPERTIES Insulator Material PA66 Insulator Flammability Rating UL94 V-0 Contact Material Brass Contact Plating Tin GENERAL INFORMATION Operating Temperature -40 up to +105 °C Compliance RoHS ELECTRICAL PROPERTIES IR cULus 20 A Working Voltage [cULus] 300 V (AC) Withstanding Voltage [cULus] 1600 V (AC) Contact Resistance [cULus] 20 mΩ CERTIFICATION cULus Approval E315414 <https://www.we-online.com/catalog/media/o33264v209%20Family_WR-TBL_69131341000x.jpg> Details see: https://www.we-online.com/catalog/en/TBL_7_62_3134_CLOSE_HORIZONTAL_PCB_HEADER_69131341000X/ Updated by Ella Wu 2019-12-30 2022(C) Wurth Elektronik; DATASHEET-URL: https://www.we-online.com/redexpert/spec/691313410003?ae; IR-UL: 20A; MOUNT: THT; PART-NUMBER: 691313410003; PINS: 3; PITCH: 7.62mm; TYPE: Horizontal; WORKING-VOLTAGE-UL: 300V (AC)
JP1 JP2 = pinhead:PINHD-1X2: PIN HEADER
K1-K6 = G5Q_14_DC5:G5Q-14_DC5; COPYRIGHT: Copyright (C) 2024 Ultra Librarian. All rights reserved.; MANUFACTURER_PART_NUMBER: G5Q-14 DC5; MFR_NAME: Omron
K7 = G2RL_2_DC5:G2RL-2_DC5; COPYRIGHT: Copyright (C) 2025 Ultra Librarian. All rights reserved.; MANUFACTURER_PART_NUMBER: G2RL-2 DC5; MFR_NAME: Omron
K8 = Omron G2RG-2A4:OMRON_G2RG-2A-XDC12
LED1-LED5 = SparkFun-LED:LED: LED (Generic) Standard schematic elements and footprints for 5mm, 3mm, 1206, and 0603 sized LEDs. Generic LEDs with no color specified.
PS1 = ULS-12_5-D48N-C:ULS-12/5-D48N-C; MANUFACTURER: MURATA POWER SOLUTIONS; STANDARD: Manufacturer Recommendations
PS3 = REC20K_2405SZ:REC20K-2405SZ; COPYRIGHT: Copyright (C) 2025 Ultra Librarian. All rights reserved.; MANUFACTURER_PART_NUMBER: REC20K-2405SZ; MFR_NAME: Recom Power
R1-R47 = adafruit:R-US_: RESISTOR, American symbol
SW1 SW2 = 1825910_6:1825910-6; COPYRIGHT: Copyright (C) 2025 Ultra Librarian. All rights reserved.; MANUFACTURER_PART_NUMBER: 1825910-6; MFR_NAME: TE Connectivity
TP1-TP25 TP38 TP39 TP42 TP43 = testpad:TH
U1 U15 U17 = R_78K5_0_0_5:R-78K5.0-0.5; COPYRIGHT: Copyright (C) 2025 Ultra Librarian. All rights reserved.; MANUFACTURER_PART_NUMBER: R-78K5.0-0.5; MFR_NAME: Recom Power; TYPE: DC DC Converters
U2 U5 = Eagle_MAGIC-FISM_rev22c:WPME-FISM_SMT-8: MagI³C-FISM Fixed Isolated SIP / SMT Module Unregulated output voltage Characteristics Simple design (no transformer design know how required) Leaded through-hole package for easy manufacturing and prototyping Stand-alone solution (CIN and COUT integrated, no external components) Simple functional isolation for overvoltage protection, avoiding ground loops, ground shift and noise in signal path or sensor systems Industrial standard package and pin configuration Low conducted and radiated EMI (compliant to EN55022 class B) UL60950 certified Applications Data acquisition Test and measurement systems Interface and microcontroller supply Industrial control <https://www.we-online.com/catalog/media/o84919v209%20Family_WE-FISM.jpg> Details see: www.we-online.com//components/products/MAGIC-FISM <www.we-online.com/catalog/MAGIC-FISM/?utm_source=eagle_model&utm_medium=description_link&utm_campaign=eisos_eagle> Updated by Ella Wu 2023-09-01 2023 (C) Wurth Elektronik; DATASHEET-URL: https://www.we-online.com/redexpert/spec/1769205241?ae; HEIGHT: 7.25mm; LENGTH: 13.2mm; MOUNT: SMT; PART-NUMBER: 1769205241; PO: 1W; SHORT-CIRCUIT-PROTECTION: continous; SIZE: SMT-8; VALUE: 10.8-13.2Vin, 5Vout; VISO: 3000V; VOLTAGE-INPUT: 10.8-13.2V; VOLTAGE-OUTPUT: 5V; WIDTH: 11.4mm
U3 = SM712_TCT:SM712.TCT; COPYRIGHT: Copyright (C) 2024 Ultra Librarian. All rights reserved.; MANUFACTURER_PART_NUMBER: SM712.TCT; MFR_NAME: Semtech
U4 U6 U7 U9 U16 = TPS1H200AQDGNRQ1:TPS1H200AQDGNRQ1: Check availability <https://pricing.snapeda.com/parts/TPS1H200AQDGNRQ1/Texas%20Instruments/view-part?ref=eda>; AVAILABILITY: In Stock; CHECK_PRICES: https://www.snapeda.com/parts/TPS1H200AQDGNRQ1/Texas+Instruments/view-part/?ref=eda; DESCRIPTION: 40-V, 200-mΩ, 1-ch automotive smart high-side switch with adjustable current limit; MF: Texas Instruments; MP: TPS1H200AQDGNRQ1; PACKAGE: HVSSOP-8 Texas Instruments; PRICE: None; PURCHASE-URL: https://www.snapeda.com/api/url_track_click_mouser/?unipart_id=3210362&manufacturer=Texas Instruments&part_name=TPS1H200AQDGNRQ1&search_term=tps1h200aqdgnrq1; SNAPEDA_LINK: https://www.snapeda.com/parts/TPS1H200AQDGNRQ1/Texas+Instruments/view-part/?ref=snap
U8 = MAX22026FAWA:MAX22026FAWA+; COPYRIGHT: Copyright (C) 2024 Ultra Librarian. All rights reserved.; MANUFACTURER_PART_NUMBER: MAX22026FAWA+; MFR_NAME: Analog Devices / Maxim Integrated; TYPE: Interface
U10 = HDC3022QDEJRQ1:HDC3022QDEJRQ1; COPYRIGHT: Copyright (C) 2025 Ultra Librarian. All rights reserved.; MANUFACTURER_PART_NUMBER: HDC3022QDEJRQ1; MFR_NAME: Texas Instruments; TYPE: Humidity, Moisture Sensors
U11 U12 = ISO7742DWR:ISO7742DWR; COPYRIGHT: Copyright (C) 2024 Ultra Librarian. All rights reserved.; MANUFACTURER_PART_NUMBER: ISO7742DWR; MFR_NAME: Texas Instruments; REFDES: RefDes; TYPE: TYPE
U13 = ISO7740DWR:ISO7740DWR; COPYRIGHT: Copyright (C) 2024 Ultra Librarian. All rights reserved.; MANUFACTURER_PART_NUMBER: ISO7740DWR; MFR_NAME: Texas Instruments; REFDES: RefDes; TYPE: TYPE
U14 = MAX7320AEE_T:MAX7320AEE+T; COPYRIGHT: Copyright (C) 2025 Ultra Librarian. All rights reserved.; MANUFACTURER_PART_NUMBER: MAX7320AEE+T; MFR_NAME: Analog Devices / Maxim Integrated
U18 = AT24CM02_SSHD_B:AT24CM02-SSHD-B; COPYRIGHT: Copyright (C) 2025 Ultra Librarian. All rights reserved.; MANUFACTURER_PART_NUMBER: AT24CM02-SSHD-B; MFR_NAME: Microchip
U19 = PKU4913DPIHS:PKU4913DPIHS; COPYRIGHT: Copyright (C) 2025 Ultra Librarian. All rights reserved.; DIGI-KEY_PART_NUMBER_1: 2166-PKU4913DPIHS-ND; MANUFACTURER_NAME: Flex Power Modules; MANUFACTURER_PART_NUMBER: PKU4913DPIHS; TYPE: DC DC Converters
U20 = SKA60C_12:SKA60C-12; COPYRIGHT: Copyright (C) 2025 Ultra Librarian. All rights reserved.; MANUFACTURER_NAME: Mean Well; MANUFACTURER_PART_NUMBER: SKA60C-12
U21 = R-78K3.3-2.0:R-78K3.3-2.0; CHECK_PRICES: https://www.snapeda.com/parts/R-78K3.3-2.0/Recom+Power/view-part/?ref=eda; DESCRIPTION: DC-DC Converter, 1 Output, 4.5-36Vin, 3.3V/2A Output, SIP3, R-78K-2.0 Series | RECOM Power Inc. R-78K3.3-2.0; DIGIKEY_PART_NUMBER: 945-R-78K3.3-2.0-ND; MF: Recom Power; MP: R-78K3.3-2.0; PACKAGE: None; SNAPEDA_LINK: https://www.snapeda.com/parts/R-78K3.3-2.0/Recom+Power/view-part/?ref=snap
U22 = TXU0104PWR:TXU0104PWR; COPYRIGHT: Copyright (C) 2025 Ultra Librarian. All rights reserved.; DATASHEET: https://www.ti.com/lit/gpn/txu0104; DESCRIPTION: Four channel unidirectional level shifter 14-TSSOP -40 to 125; MANUFACTURER_NAME: Texas Instruments; MANUFACTURER_PART_NUMBER: TXU0104PWR
U23 = PCA9632TK,118:PCA9632TK,118; COPYRIGHT: Copyright (C) 2025 Ultra Librarian. All rights reserved.; DIGI-KEY_PART_NUMBER_1: 568-8715-2-ND; DIGI-KEY_PART_NUMBER_2: 568-8715-1-ND; DIGI-KEY_PART_NUMBER_3: 568-8715-6-ND; MANUFACTURER_NAME: NXP; MANUFACTURER_PART_NUMBER: PCA9632TK,118
U24 = TXU0101DCKR:TXU0101DCKR; COPYRIGHT: Copyright (C) 2025 Ultra Librarian. All rights reserved.; DESCRIPTION: Single channel fixed-direction level shifter 6-SC70 -40 to 125; MANUFACTURER_NAME: Texas Instruments; MANUFACTURER_PART_NUMBER: TXU0101DCKR
U$1 = meanwell SPBW03:MEANWELLSPBW03G-12

## Net classes
1 Power: clearance 0.508 mm to class 0, clearance 0.508 mm